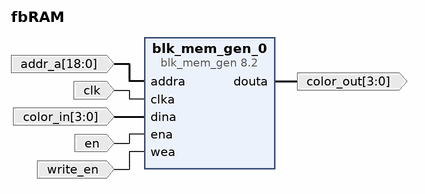
[diagram p0: block diagram of the top level]
# Vivado block design fbRAM, Vivado 2015.2
create_bd_design fbRAM

create_bd_port -dir I -from 18 -to 0 addr_a
create_bd_port -dir I clk
create_bd_port -dir I -from 3 -to 0 color_in
create_bd_port -dir O -from 3 -to 0 color_out
create_bd_port -dir I en
create_bd_port -dir I write_en

create_bd_cell -type ip -vlnv xilinx.com:ip:blk_mem_gen:8.2 blk_mem_gen_0
set_property -dict [list \
  CONFIG.Memory_Type Single_Port_RAM \
  CONFIG.Enable_32bit_Address false \
  CONFIG.Use_Byte_Write_Enable false \
  CONFIG.Write_Width_A 4 \
  CONFIG.Write_Depth_A 307200 \
  CONFIG.Read_Width_A 4 \
  CONFIG.Operating_Mode_A READ_FIRST \
  CONFIG.Register_PortA_Output_of_Memory_Primitives true \
  CONFIG.Use_RSTA_Pin false \
  CONFIG.Port_B_Clock 0 \
  CONFIG.Port_B_Write_Rate 0 \
  CONFIG.Port_B_Enable_Rate 0 \
  CONFIG.use_bram_block Stand_Alone \
] [get_bd_cells blk_mem_gen_0]

# ---- connections ----

connect_bd_net [get_bd_ports addr_a] [get_bd_pins blk_mem_gen_0/addra]
connect_bd_net [get_bd_ports clk] [get_bd_pins blk_mem_gen_0/clka]
connect_bd_net [get_bd_ports color_in] [get_bd_pins blk_mem_gen_0/dina]
connect_bd_net [get_bd_pins blk_mem_gen_0/douta] [get_bd_ports color_out]
connect_bd_net [get_bd_ports en] [get_bd_pins blk_mem_gen_0/ena]
connect_bd_net [get_bd_ports write_en] [get_bd_pins blk_mem_gen_0/wea]

validate_bd_design
save_bd_design
